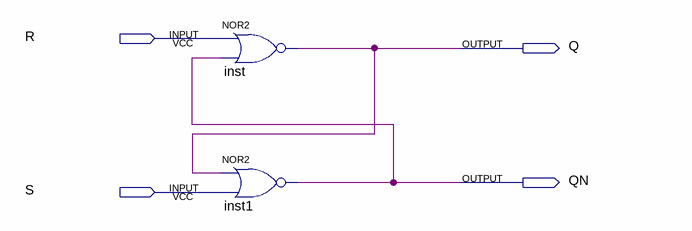
[diagram p0: schematic sheet]
// Quartus schematic SRLatchNor.bdf as structural Verilog: 2 symbols, 4 pins
module SRLatchNor (
  input  R,
  input  S,
  output Q,
  output QN
);

  nor inst (Q, R, QN);
  nor inst1 (QN, Q, S);
endmodule
